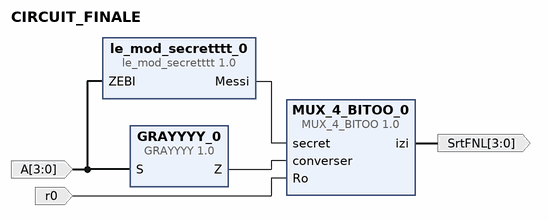
[diagram p0: block diagram of the top level]
# Vivado block design CIRCUIT_FINALE, xc7a100tcsg324-1, Vivado 2018.3
create_bd_design CIRCUIT_FINALE

create_bd_port -dir I -from 3 -to 0 A
create_bd_port -dir I r0
create_bd_port -dir O -from 3 -to 0 SrtFNL

create_bd_cell -type ip -vlnv polymtl.ca:user:GRAYYYY:1.0 GRAYYYY_0
create_bd_cell -type ip -vlnv polymtl.ca:user:le_mod_secretttt:1.0 le_mod_secretttt_0
create_bd_cell -type ip -vlnv polymtl.ca:user:MUX_4_BITOO:1.0 MUX_4_BITOO_0

# ---- connections ----

connect_bd_net [get_bd_ports A] [get_bd_pins GRAYYYY_0/S] [get_bd_pins le_mod_secretttt_0/ZEBI]
connect_bd_net [get_bd_pins GRAYYYY_0/Z] [get_bd_pins MUX_4_BITOO_0/converser]
connect_bd_net [get_bd_pins le_mod_secretttt_0/Messi] [get_bd_pins MUX_4_BITOO_0/secret]
connect_bd_net -net r0_1 [get_bd_ports r0] [get_bd_pins MUX_4_BITOO_0/Ro]
connect_bd_net [get_bd_pins MUX_4_BITOO_0/izi] [get_bd_ports SrtFNL]

validate_bd_design
save_bd_design
